# EAGLE design slaveboard (EAGLE 7.0.0)
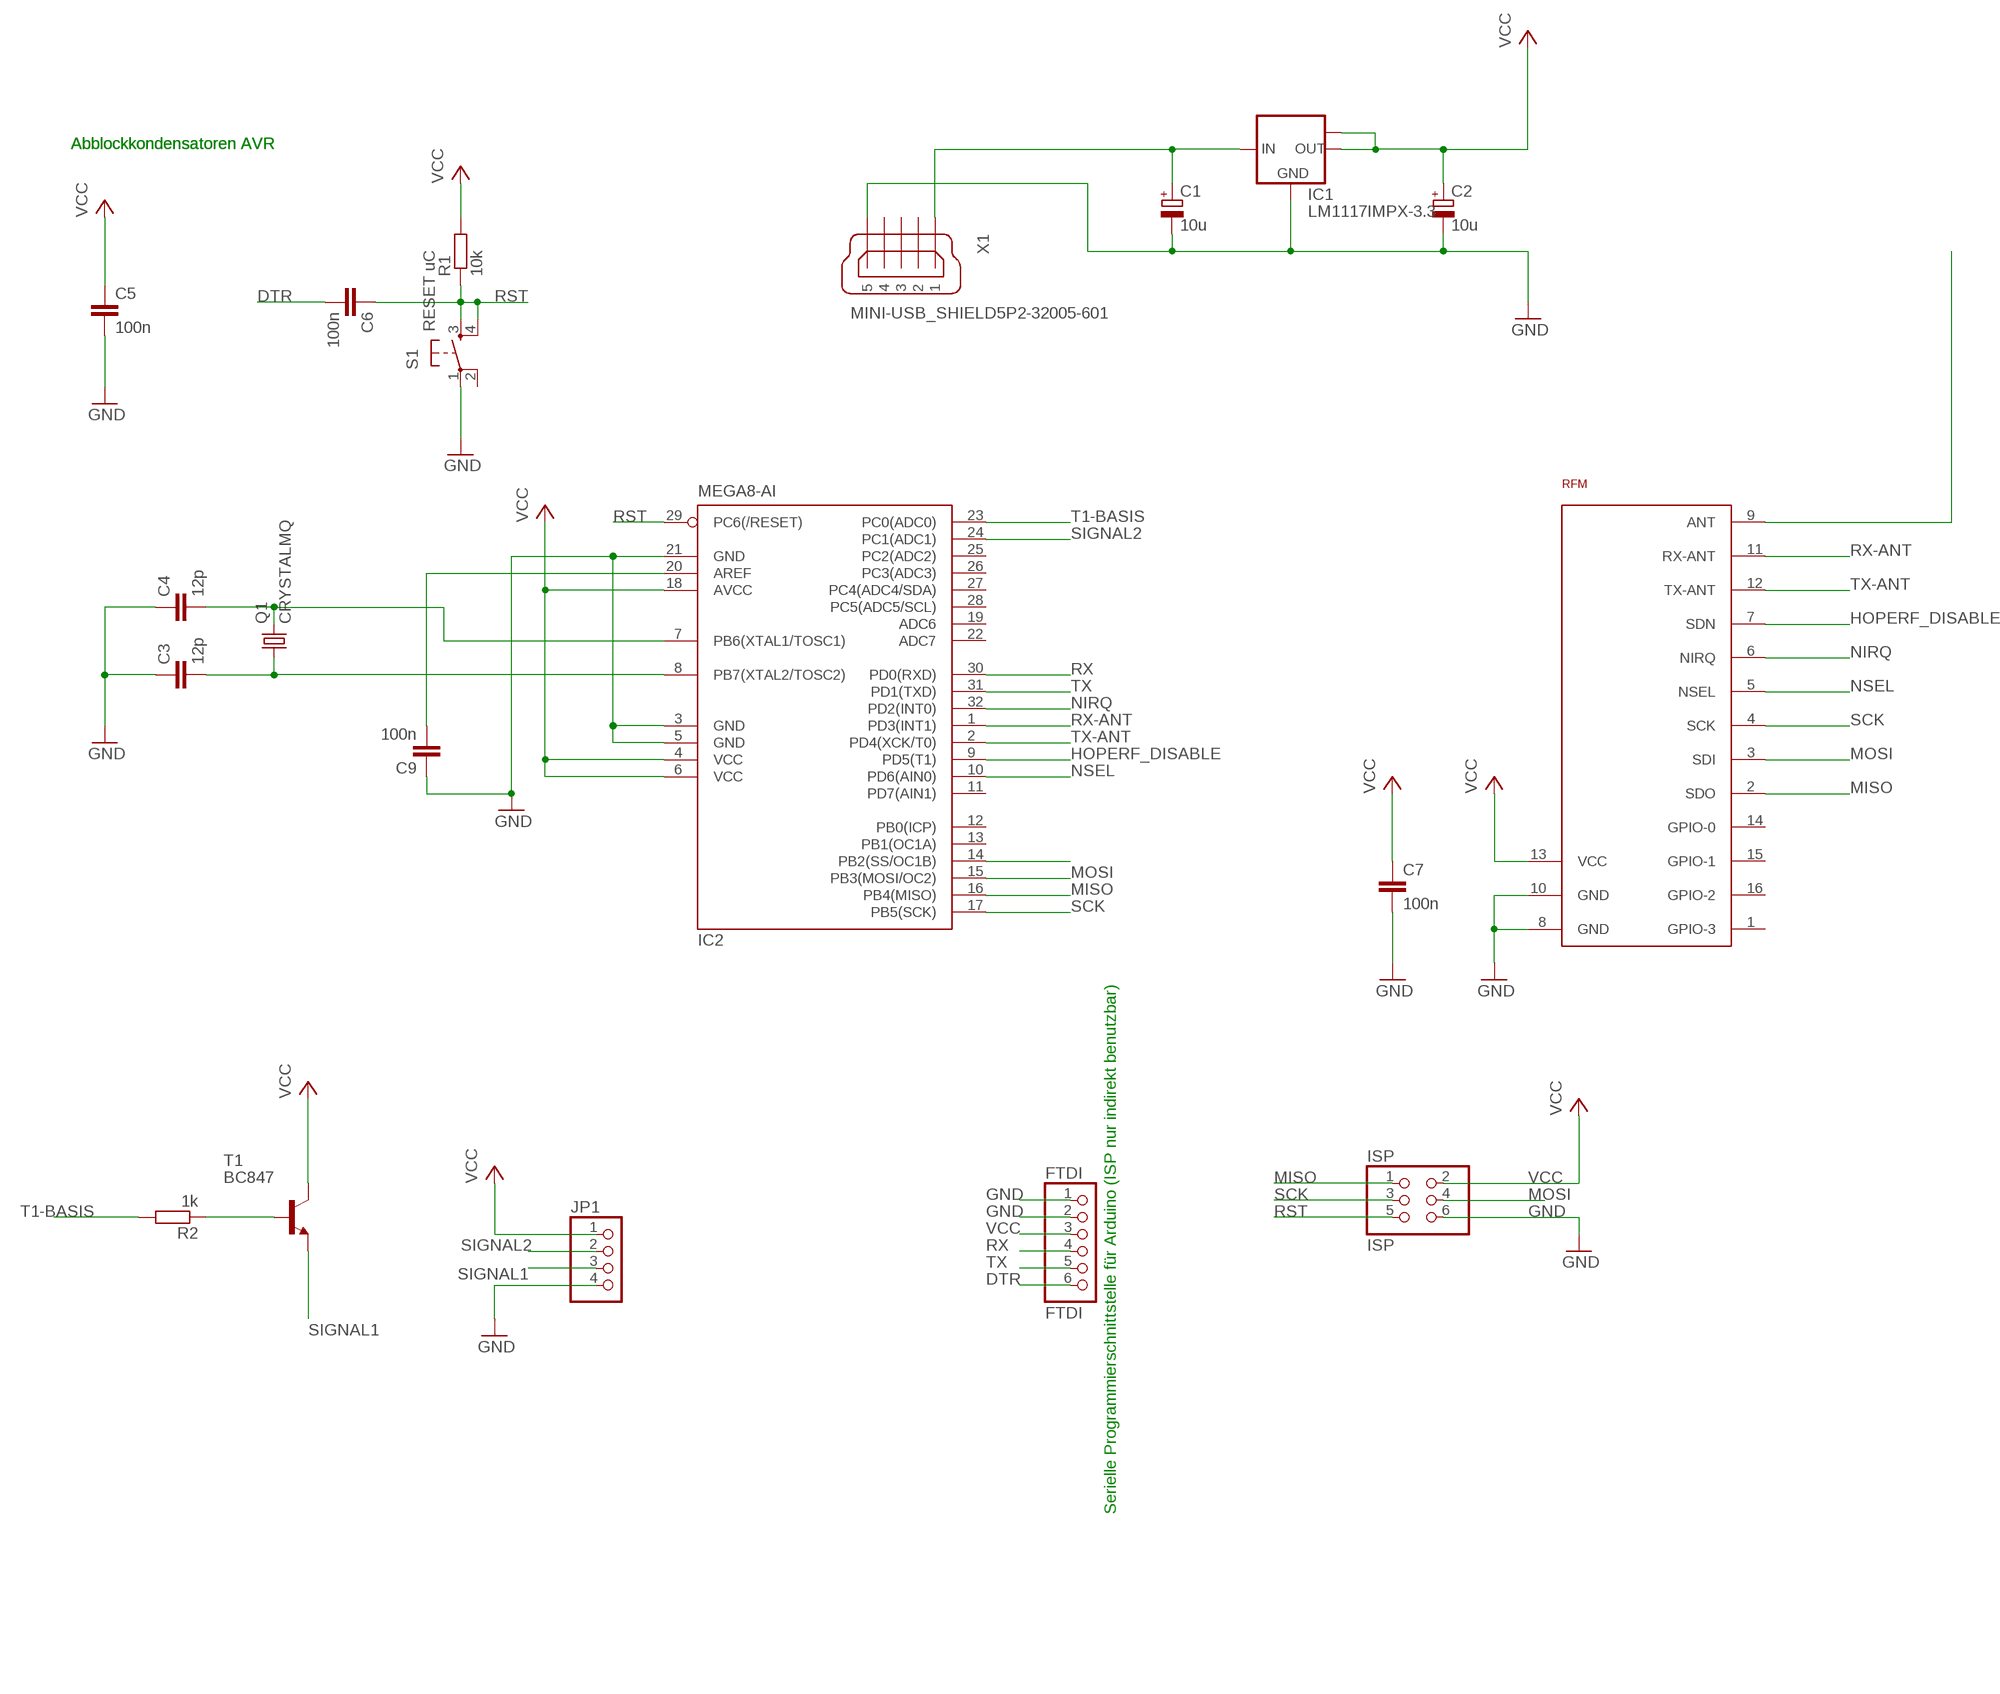
[diagram p0: schematic, sheet 1]

## Parts
C1  10u  CPOL-EUCT6032  [CT6032]
C2  10u  CPOL-EUCT6032  [CT6032]
C3  12p  C-EUC0603  [C0603]
C4  12p  C-EUC0603  [C0603]
C5  100n  C-EUC0603  [C0603]
C6  100n  C-EUC0603  [C0603]
C7  100n  C-EUC0603  [C0603]
C9  100n  C-EUC0603  [C0603]
FTDI  FTDI  PINHD-1X6/90  [1X06/90]
IC1  LM1117IMPX-3.3  [SOT223]
IC2  MEGA8-AI  [TQFP32-08]
ISP  ISP  PINHD-2X3  [2X03]
JP1  PINHD-1X4/90  [1X04/90]
Q1  CRYSTALMQ  [MQ]
R1  10k  R-EU_R0805  [R0805]
R2  1k  R-EU_R0805  [R0805]
RFM  HOPERF-DB  [HOPERF-DB]
S1  RESET uC  10-XXB3FRAFI  [RAFI]
T1  BC847  [SOT23]
X1  MINI-USB_SHIELD5P2-32005-601  [32005-601]

## Nets
DTR: C6.2 FTDI.6
GND: C1.- C2.- C3.1 C4.1 C5.2 C7.2 C9.1 FTDI.1 FTDI.2 IC1.1(GND) IC2.3(GND) IC2.5(GND) IC2.21(GND) ISP.6 JP1.4 RFM.8(GND) RFM.10(GND) S1.1(P) X1.5
HOPERF_DISABLE: IC2.9(PD5(T1)) RFM.7(SDN)
MISO: IC2.16(PB4(MISO)) ISP.1 RFM.2(SDO)
MOSI: IC2.15(PB3(MOSI/OC2)) ISP.4 RFM.3(SDI)
N$1: C3.2 IC2.8(PB7(XTAL2/TOSC2)) Q1.P1
N$2: C4.2 IC2.7(PB6(XTAL1/TOSC1)) Q1.P3
N$3: C1.+ IC1.3(IN) X1.1
N$4: IC2.14(PB2(SS/OC1B))
N$5: C9.2 IC2.20(AREF)
N$8: RFM.9(ANT)
N$11: R2.1 T1.1(B)
NIRQ: IC2.32(PD2(INT0)) RFM.6(NIRQ)
NSEL: IC2.10(PD6(AIN0)) RFM.5(NSEL)
RST: C6.1 IC2.29(PC6(/RESET)) ISP.5 R1.1 S1.3(S) S1.4(S1)
RX: FTDI.4 IC2.30(PD0(RXD))
RX-ANT: IC2.1(PD3(INT1)) RFM.11(RX-ANT)
SCK: IC2.17(PB5(SCK)) ISP.3 RFM.4(SCK)
SIGNAL1: JP1.3 T1.2(E)
SIGNAL2: IC2.24(PC1(ADC1)) JP1.2
T1-BASIS: IC2.23(PC0(ADC0)) R2.2
TX: FTDI.5 IC2.31(PD1(TXD))
TX-ANT: IC2.2(PD4(XCK/T0)) RFM.12(TX-ANT)
VCC: C2.+ C5.1 C7.1 FTDI.3 IC1.2(OUT) IC1.TAB(OUT1) IC2.4(VCC) IC2.6(VCC) IC2.18(AVCC) ISP.2 JP1.1 R1.2 RFM.13(VCC) T1.3(C)
Unconnected: IC2.11(PD7(AIN1)) IC2.12(PB0(ICP)) IC2.13(PB1(OC1A)) IC2.19(ADC6) IC2.22(ADC7) IC2.25(PC2(ADC2)) IC2.26(PC3(ADC3)) IC2.27(PC4(ADC4/SDA)) IC2.28(PC5(ADC5/SCL)) Q1.P2(GND) Q1.P4(GND1) RFM.1(GPIO-3) RFM.14(GPIO-0) RFM.15(GPIO-1) RFM.16(GPIO-2) S1.2(P1) X1.2 X1.3 X1.4 X1.M1(S1) X1.M2(S2)

## Notes on the sheet
- Abblockkondensatoren AVR | Abblockkondensatoren AVR
- Serielle Programmierschnittstelle für Arduino (ISP nur indirekt benutzbar)

## Library data of the parts
C1 C2 = rcl:CPOL-EU: POLARIZED CAPACITOR, European symbol
C3-C7 C9 = rcl:C-EU: CAPACITOR, European symbol
FTDI = pinhead:PINHD-1X6: PIN HEADER
IC1 = lm1117:LM1117IMPX-*
IC2 = atmel:MEGA8: MICROCONTROLLER 8 Kbytes FLASH, 1 kbytes SRAM, 512 bytes EEPROM, USART, 6-channel 10 bit ADC, 2-channel 8 bit ADC Pin compatible with Atmega48, ATMega88, ATMega168 Source: avr.lbr; MPN: ATMEGA8-16AU; OC_FARNELL: 9171371; OC_NEWARK: 73M8863
ISP = pinhead:PINHD-2X3: PIN HEADER
JP1 = pinhead:PINHD-1X4: PIN HEADER
Q1 = Crystals-new:CRYSTAL
R1 R2 = rcl:R-EU_: RESISTOR, European symbol
RFM = hoperf_rfm24w:HOPERF-DB
S1 = switch-omron:10-XX: OMRON SWITCH
T1 = transistor-neu-to92:BC847: NPN TRANSISTOR
X1 = con-cypressindustries:MINI-USB_SHIELD5P2-: MINI USB-B R/A DIP 5pol. Source: www.cypressindustries.com; OC_FARNELL: unknown; OC_NEWARK: unknown

## Board
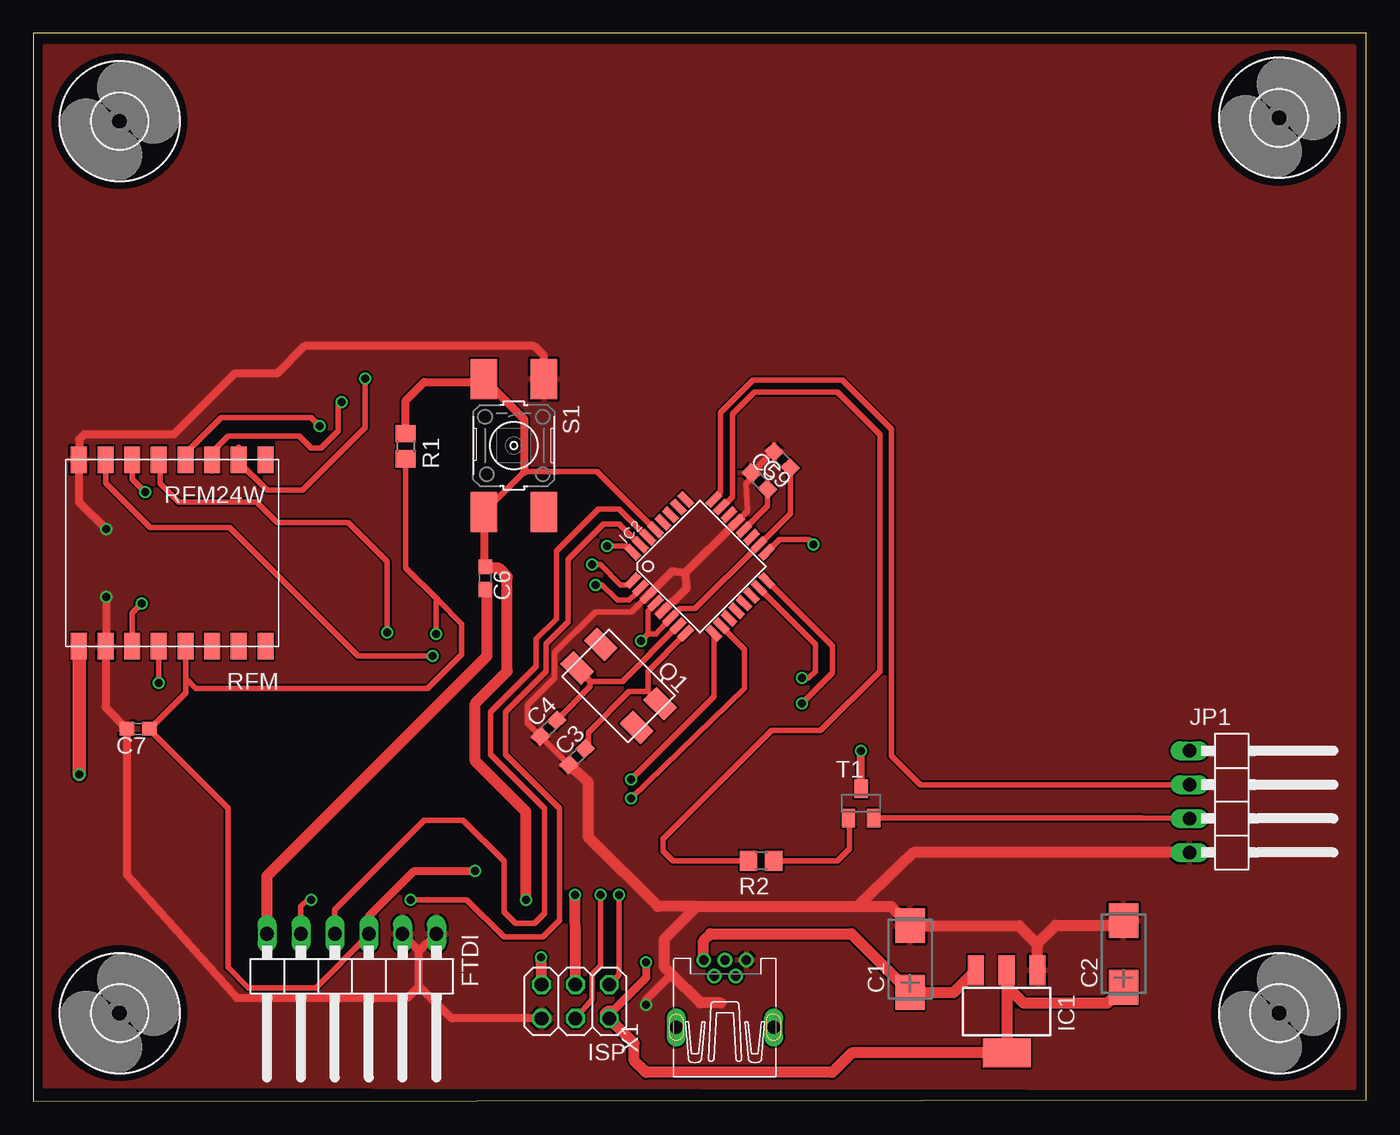
[diagram p1: board, top side]
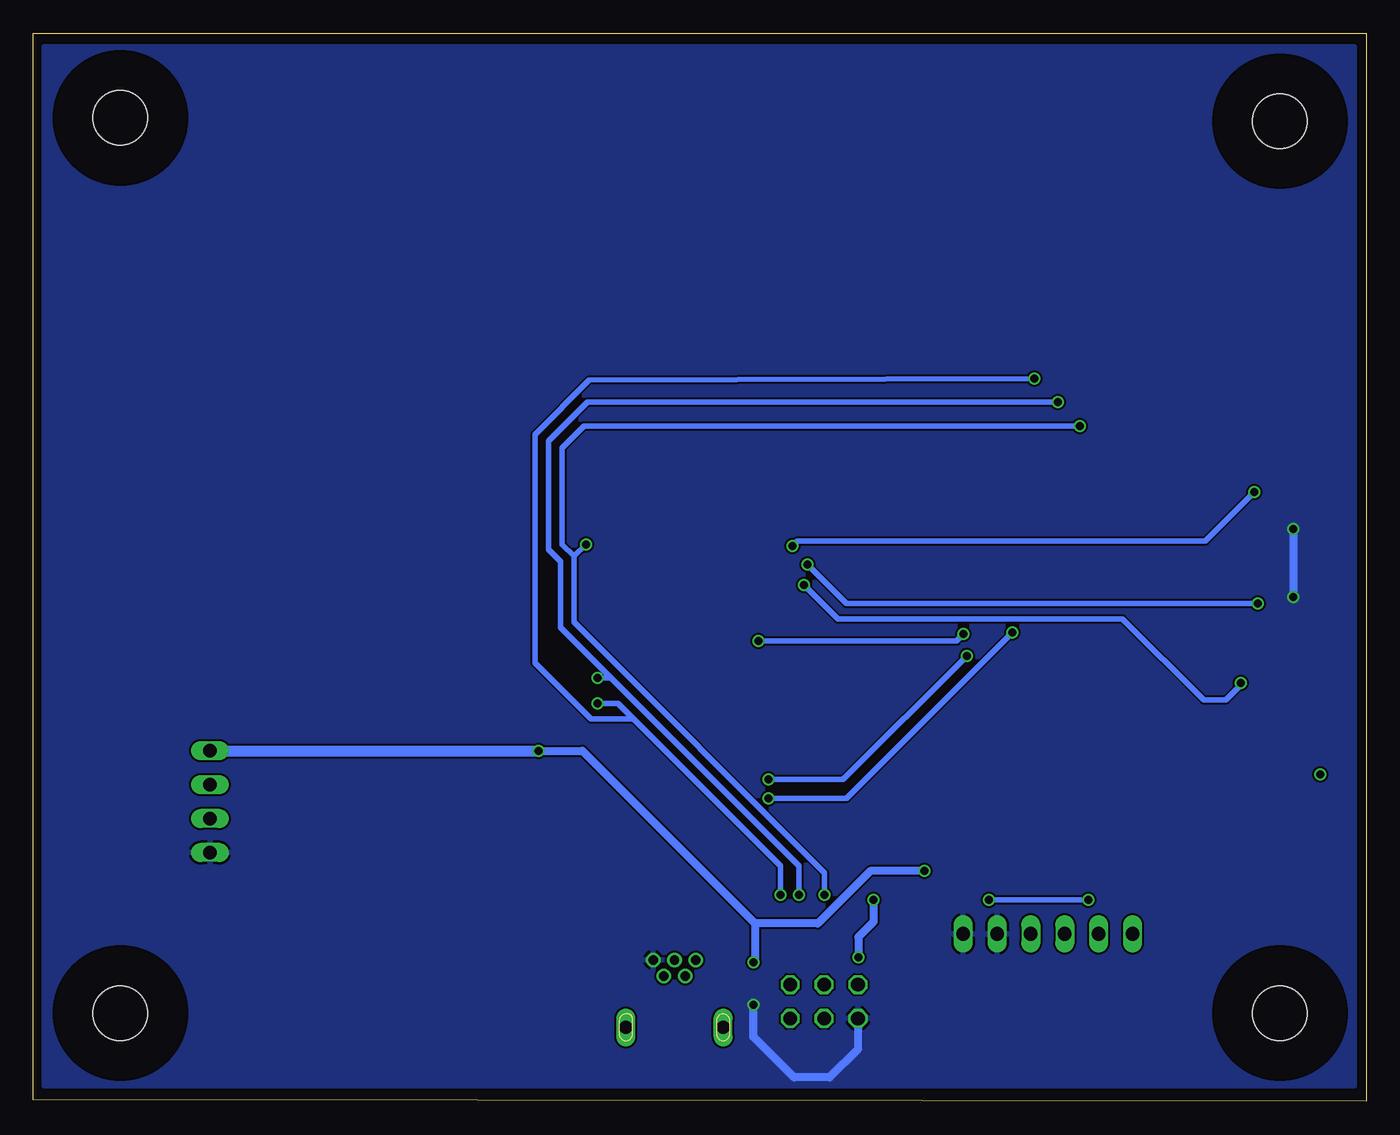
[diagram p2: board, bottom side, seen from below]

Size 100 x 80.13 mm. Coordinates in mm from the lower left corner, seen from the top.
Outline: 0,0 100,0.13 100,80.13 0,80.13 0,0
Copper layers (1*16): Top 0.035mm / dielectric 1.5mm / Bottom 0.035mm
Design rules "EAGLE Design-Rules": minimum track width 0.15mm, minimum drill 0.3mm, track to track 0.15mm, track to pad 0.15mm, pad to pad 0.15mm, via to via 0.15mm, smd to smd 0.15mm, copper to edge 0.3mm, drill to drill 0.2mm, minimum pad ring 0.2mm, minimum via ring 0.15mm, stop-mask expansion 0.075mm, vias tented up to drill 0mil, thermal gap 0.2mm

### Footprints (pad centres in the part's own frame; a part is rotated, then mirrored left to right if it is on the bottom)
CT6032 = smd 2.6 x 2.2: + -2.5,0; - 2.5,0
C0603 = smd 1.1 x 1: 1 -0.85,0; 2 0.85,0
1X06/90 = drill 1.016 long: 1 -6.35,-3.81; 2 -3.81,-3.81; 3 -1.27,-3.81; 4 1.27,-3.81; 5 3.81,-3.81; 6 6.35,-3.81
SOT223 = smd 1.219 x 2.235: 1 -2.311,-3.099; 2 0,-3.099; 3 2.311,-3.099 | smd 3.6 x 2.2: TAB 0,3.099
TQFP32-08 = smd 1.27 x 0.559: 1 -4.293,2.8; 2 -4.293,2; 3 -4.293,1.2; 4 -4.293,0.4; 5 -4.293,-0.4; 6 -4.293,-1.2; 7 -4.293,-2; 8 -4.293,-2.8; 17 4.293,-2.8; 18 4.293,-2; 19 4.293,-1.2; 20 4.293,-0.4; 21 4.293,0.4; 22 4.293,1.2; 23 4.293,2; 24 4.293,2.8 | smd 0.559 x 1.27: 9 -2.8,-4.293; 10 -2,-4.293; 11 -1.2,-4.293; 12 -0.4,-4.293; 13 0.4,-4.293; 14 1.2,-4.293; 15 2,-4.293; 16 2.8,-4.293; 25 2.8,4.293; 26 2,4.293; 27 1.2,4.293; 28 0.4,4.293; 29 -0.4,4.293; 30 -1.2,4.293; 31 -2,4.293; 32 -2.8,4.293
2X03 = drill 1.016 octagon: 1 -2.54,-1.27; 2 -2.54,1.27; 3 0,-1.27; 4 0,1.27; 5 2.54,-1.27; 6 2.54,1.27
1X04/90 = drill 1.016 long: 1 -3.81,-3.81; 2 -1.27,-3.81; 3 1.27,-3.81; 4 3.81,-3.81
MQ = smd 2.2 x 1.4: P1 -3.15,-1.25; P2 3.15,-1.25; P3 3.15,1.25; P4 -3.15,1.25
R0805 = smd 1.3 x 1.5: 1 -0.95,0; 2 0.95,0
HOPERF-DB = smd 1.2 x 2: 1 1,0; 2 3,0; 3 5,0; 4 7,0; 5 9,0; 6 11,0; 7 13,0; 8 15,0; 9 15,14; 10 13,14; 11 11,14; 12 9,14; 13 7,14; 14 5,14; 15 3,14; 16 1,14
RAFI = smd 3 x 2: 1 -5,2.25; 2 5,2.25; 3 -5,-2.25; 4 5,-2.25
SOT23 = smd 1 x 1.4: 1 -0.95,-1.1; 2 0.95,-1.1; 3 0,1.1
4,1 = hole 4.1: 0,0
32005-601 = drill 0.7 pad 1.016: 1 2.825,1.6; 2 1.625,0.8; 3 2.825,0; 4 1.625,-0.8; 5 2.825,-1.6 | drill 1 pad 1.422 long: M1 -2.225,3.65; M2 -2.225,-3.65

### Placement (x,y rotation side)
C1  65.79,10.67 90 top
C2  81.79,11.05 90 top
C3  40.79,25.85 45 top
C4  38.66,27.99 45 top
C5  56.19,48.13 135 top
C6  33.91,39.24 270 top
C7  7.87,27.94 180 top
C9  54.48,46.53 315 top
FTDI  23.89,8.75 180 top
IC1  73.03,6.73 180 top
IC2  50,40.13 45 top
ISP  40.67,7.48 180 top
JP1  90.55,22.48 270 top
Q1  43.92,31.17 135 top
R1  27.94,49.15 270 top
R2  54.61,18.03 180 top
RFM  18.41,48.13 180 top
S1  36.05,49.2 270 top
T1  62.1,22.35 0 top
U$2  [4,1]  93.47,73.79 0 top
U$3  [4,1]  93.47,6.6 0 top
U$4  [4,1]  6.48,6.6 0 top
U$5  [4,1]  6.48,73.53 0 top
X1  51.89,7.77 90 top

### Tracks (layer width: path | path; a pad name or v marks a point on that pad's centre or on a via)
DTR
  Top 0.813: FTDI.6 17.54,16.9 34.04,33.4 34.04,38.27 C6.2
GND  (via drill 0.6)
  Top 0.406: IC2.3 44.9,36.72 42.18,36.72 39.12,33.66 39.12,31.75 37.08,29.72 37.08,28.32 37.12,28.32 C4.1 C3.1 | 55.55,48.77 C5.2 55.48,48.73 C9.1 53.88,46.77 53.47,46.36 53.59,44.29 IC2.21
  Top 0.61: 48.9,39.62 47.93,39.75 IC2.3 | IC2.21 52.59,43.32 48.9,39.62 | 48.9,39.62 49.02,38.48 48.01,37.47 47.9,37.47 IC2.5 | 28.96,11.27 FTDI.1 | 28.96,11.27 28.96,11.3 FTDI.2 | ISP.6 31.39,6.21 28.96,8.64 | v45.97,7.24 45.97,7.62 47.88,9.53 | v5.46,42.93 3.42,44.97 RFM.8 3.43,48.15 3.43,49.66 3.81,50.04 10.54,50.04 15.11,54.61 18.29,54.61 20.32,56.64 37.59,56.64 38.3,55.93 S1.1 | v5.46,37.85 5.46,34.18 RFM.10 5.42,29.55 C7.2 7.02,16.98 15.24,7.75 28.07,7.75 28.96,8.64 | 28.96,8.64 28.96,11.27
  Top 0.813: 49.78,14.61 47.37,12.19 47.37,10.03 47.88,9.53 50.04,7.37 51.56,7.37 | 49.78,14.61 61.85,14.61 | 61.85,14.61 64.35,14.61 C1.- 73.95,13.17 75.31,11.81 | 75.49,9.83 IC1.1 75.34,11.66 75.31,11.68 75.31,11.81 | 49.78,14.61 46.86,14.61 41.66,19.81 41.66,23.92 C3.1 | JP1.4 66.04,18.67 61.85,14.61 | 75.31,11.81 76.71,13.21 81.15,13.21 81.49,13.55 C2.-
  Bottom 0.61: ISP.6 38.13,3.91 40.26,1.78 42.93,1.78 45.97,4.83 v45.97,7.24 | v5.46,42.93 v5.46,37.85
  pour Top: 0.89,79.12 99.06,79.12 99.06,1.02 0.89,1.14
  pour Bottom: 0.89,79.12 99.19,79.12 99.19,1.14 0.89,1.14
HOPERF_DISABLE  (via drill 0.6)
  Top 0.406: RFM.7 5.42,46.4 8.76,43.05 14.73,43.05 24.38,33.4 v29.97,33.4 | IC2.9 51.05,30.35 v44.83,24.13
  Bottom 0.406: v44.83,24.13 39.24,24.13 v29.97,33.4
MISO  (via drill 0.6)
  Top 0.406: IC2.16 55.03,39.07 59.94,34.16 59.94,32.13 v57.66,29.84 | v43.94,15.49 43.94,9.48 ISP.1 | 15.41,49.07 RFM.2 15.41,47.96 17.53,45.85 20.19,45.85 24.89,50.55 v24.89,54.23
  Bottom 0.406: v57.66,29.84 56.13,29.84 55.05,28.77 | 55.05,28.77 43.94,17.65 v43.94,15.49 | v24.89,54.23 58.29,54.1 62.36,50.04 62.36,32.89 58.17,28.7 55.12,28.7 55.05,28.77
MOSI  (via drill 0.6)
  Top 0.406: ISP.4 41.75,7.46 41.91,7.62 41.91,9.53 42.55,10.16 v42.55,15.49 | v57.66,31.75 58.17,31.75 58.67,32.26 58.67,34.28 IC2.15 | 13.41,47.29 RFM.3 13.41,48.72 14.61,49.91 19.94,49.91 20.83,49.02 21.59,49.02 22.86,50.29 22.86,52.2 v23.11,52.45
  Bottom 0.406: v42.55,15.49 42.55,17.65 56.64,31.75 | 56.64,31.75 v57.66,31.75 | v23.11,52.45 58.42,52.45 61.34,49.53 61.34,41.4 60.45,40.51 60.45,35.56 56.64,31.75
N$1
  Top 0.406: IC2.8 46.1,32.26 46.1,30.75 Q1.P1 47.01,29.82 46.1,30.73 44.7,30.73 41.66,27.69 41.66,26.71 C3.2
N$2
  Top 0.406: IC2.7 44.2,31.5 41.82,31.5 Q1.P3 40.81,32.47 41.78,31.5 41.78,31.11 C4.2
N$3
  Top 0.813: X1.1 50.29,12.06 50.8,12.57 61.38,12.57 C1.+ 69.05,8.17 IC1.3
N$5
  Top 0.406: C9.2 55.08,44.65 IC2.20
N$8  (via drill 0.6)
  Top 1.016: RFM.9 3.43,34.13 v3.43,24.51
N$11
  Top 0.406: R2.1 60.33,18.03 61.21,18.92 61.21,21.19 T1.1
NIRQ  (via drill 0.6)
  Top 0.406: RFM.6 7.42,46.69 v8.38,45.72 | v43.05,41.66 44.51,41.66 IC2.32
  Bottom 0.406: v8.38,45.72 12.06,42.04 42.67,42.04 v43.05,41.66
NSEL  (via drill 0.6)
  Top 0.406: IC2.10 51.62,35.63 53.34,33.91 53.34,30.99 v44.83,22.73 | v26.54,35.18 26.54,40.51 23.62,43.43 18.29,43.43 16.76,44.96 10.92,44.96 9.53,46.36 9.53,48.02 RFM.5
  Bottom 0.406: v44.83,22.73 38.99,22.73 v26.54,35.18
RST  (via drill 0.6)
  Top 0.406: IC2.29 46.66,42.88 42.29,47.24 36.85,47.24 S1.4
  Top 0.61: S1.4 33.8,40.2 C6.1 | R1.1 27.94,52.58 29.34,53.98 34.16,53.98 34.29,54.1 33.9,54.1 S1.3 36.85,51.15 36.85,47.24
  Top 0.813: ISP.5 38.13,10 v38.1,10.79 | v36.96,15.11 36.96,21.72 33.15,25.53 33.15,29.84 35.56,32.26 35.56,39.37 34.92,40.01 34,40.01 C6.1
  Bottom 0.61: v36.96,15.11 36.96,13.46 38.1,12.32 v38.1,10.79
RX
  Top 0.406: IC2.30 46.08,42.31 43.94,44.45 42.42,44.45 39.24,41.28 39.24,36.2 37.72,34.67 37.72,32.64 34.29,29.21 34.29,26.04 38.35,21.97 38.35,14.1 37.59,13.34 36.2,13.34 35.31,14.22 35.31,18.03 32.26,21.08 29.34,21.08 22.61,14.35 22.61,12.57 FTDI.4
RX-ANT  (via drill 0.6)
  Top 0.406: RFM.11 7.42,36.62 v8.13,37.34 | v41.91,40.26 42.55,40.26 44.07,38.73 44.65,38.73 IC2.1
  Bottom 0.406: v8.13,37.34 38.99,37.34 v41.91,40.26
SCK  (via drill 0.6)
  Top 0.406: v58.55,41.78 58.17,42.16 56,42.16 IC2.17 | 11.41,48.5 RFM.4 11.41,48.63 14.1,51.31 20.83,51.31 v21.46,50.67
  Top 0.813: ISP.3 40.67,11.15 v40.64,15.49
  Bottom 0.406: v40.64,15.49 40.64,17.14 59.44,35.94 59.44,40.89 | 59.44,40.89 v58.55,41.78 | v21.46,50.67 58.67,50.67 60.33,49.02 60.33,41.78 59.44,40.89
SIGNAL1
  Top 0.406: T1.2 83.19,21.25 JP1.3
SIGNAL2
  Top 0.406: JP1.2 66.55,23.75 64.39,25.91 64.39,50.42 60.71,54.1 53.98,54.1 51.56,51.69 51.56,45.72 51.05,45.21 IC2.24
T1-BASIS
  Top 0.406: IC2.23 51.69,44.58 52.45,45.34 52.45,51.56 54.1,53.21 60.33,53.21 63.5,50.04 63.5,32.26 59.05,27.81 55.37,27.81 47.24,19.68 47.24,18.8 48.01,18.03 R2.2
TX  (via drill 0.6)
  Top 0.406: IC2.31 45.5,41.75 43.94,43.31 42.8,43.31 40.13,40.64 40.13,35.94 38.48,34.29 38.48,32.26 35.43,29.21 35.43,26.04 39.37,22.1 39.5,21.97 39.5,13.59 38.23,12.32 35.31,12.32 32.51,15.11 v28.32,15.11 | v20.83,15.11 20.57,15.11 20.07,14.61 20.07,12.57 FTDI.5
  Bottom 0.406: v28.32,15.11 v20.83,15.11
TX-ANT  (via drill 0.6)
  Top 0.406: RFM.12 9.41,31.39 v9.4,31.37 | v42.16,38.73 42.67,38.73 43.81,37.59 44.7,37.59 45.21,38.1 IC2.2
  Bottom 0.406: v9.4,31.37 9.4,31.24 10.54,30.1 12.19,30.1 18.29,36.2 39.62,36.2 v42.16,38.73
VCC  (via drill 0.6)
  Top 0.406: RFM.13 11.41,31.75 | 11.41,31.75 11.41,30.63 C7.1 8.76,27.81 14.61,21.97 14.61,10.03 16.13,8.51 21.21,8.51 25.02,12.32 FTDI.3 | R1.2 27.94,40.01 30.35,37.59 | 30.35,37.59 32.13,35.81 32.13,33.53 29.59,30.99 12.18,30.99 11.41,31.75 | IC2.4 46.1,36.79 46.1,35.05 | C5.1 56.79,44.09 IC2.18 49.66,36.96 48.53,36.96 IC2.6 47.69,36.13 46.74,35.05 46.1,35.05 | 46.1,35.05 v45.59,34.54 | v30.23,35.05 30.23,37.47 30.35,37.59
  Top 0.61: 45.09,4.44 43.32,6.21 ISP.2 42.81,6.6 42.8,6.6 43.05,6.86 43.56,6.86 45.97,9.27 v45.97,10.41 | FTDI.3 25.16,13.86 28.57,17.27 v33.15,17.27 | 82.64,9.4 C2.+ | T1.3 v62.1,26.29
  Top 0.813: ISP.2 45.09,4.33 45.09,3.05 45.97,2.16 59.94,2.16 61.42,3.63 IC1.TAB IC1.2 73.03,8.64 74.3,7.37 80.61,7.37 C2.+
  Bottom 0.406: v45.59,34.54 30.73,34.54 v30.23,35.05
  Bottom 0.61: 45.85,13.34 45.85,10.54 v45.97,10.41 | v33.15,17.27 37.21,17.27 41.15,13.34 45.85,13.34 | 45.85,13.34 57.72,25.21 58.8,26.29 v62.1,26.29
  Bottom 0.813: JP1.1 v62.1,26.29